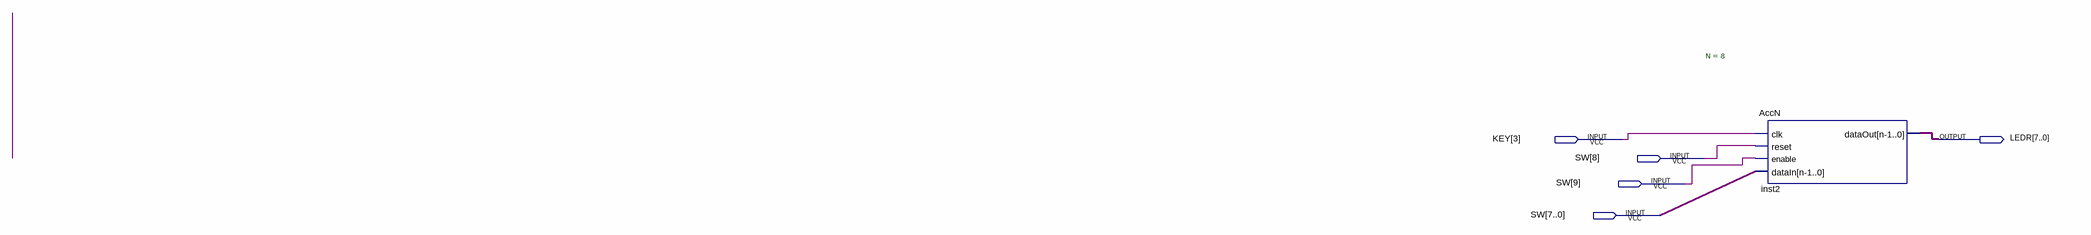
[diagram p0: schematic sheet]
// Quartus schematic AccN_Demo.bdf as structural Verilog: 1 symbols, 5 pins
module AccN_Demo (
  input  [3:3] KEY,
  input  [9:0] SW,
  output [7:0] LEDR
);

  AccN #(.N(8)) inst2 (.clk(KEY[3]), .reset(SW[8]), .enable(SW[9]), .dataIn(SW[7:0]), .dataOut(LEDR));
endmodule
